# Altium schematic sheet ESP8266 MODULE.SchDoc
size A; SheetNumber: 15; SheetTotal: 30
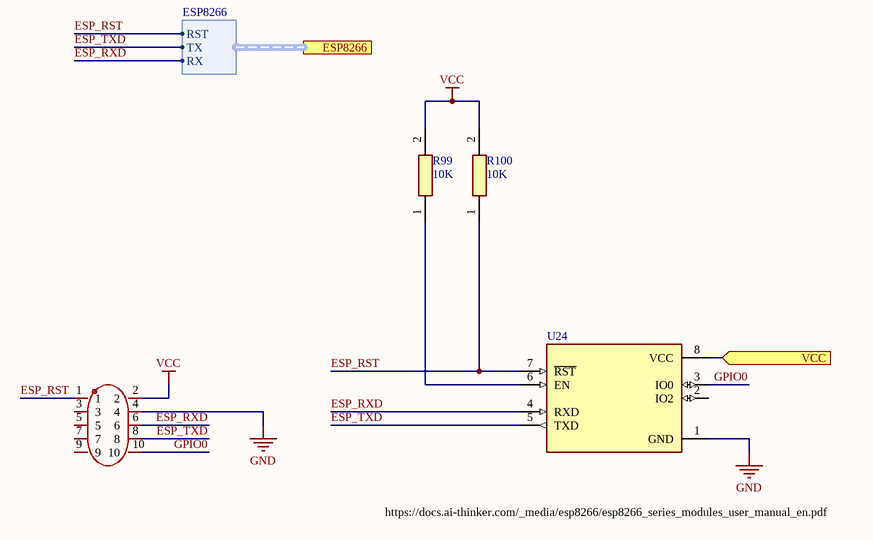
[diagram p0: ESP8266 MODULE.SchDoc]

## Parts
R99  10K  [r-0603]
R100  10K  [r-0603]
U24  (no value)  [XCVR_ESP8266-01/ESP-01]
U31  (no value)  [HDR-TH_10P-P2.54-V-M-R2-C5-S2.54]

## Ports
ESP8266 (harness ESP8266), VCC (in)

## Harnesses
ESP8266: RST, TX, RX

## Nets
GND: U24.1(GND) U31.4
VCC: R99.2 R100.2 U31.2
ESP_RST: R100.1 U24.7(~{RST}) U31.1 ; port ESP8266.RST
ESP_RXD: U24.4(RXD) U31.6 ; port ESP8266.RX
ESP_TXD: U24.5(TXD) U31.8 ; port ESP8266.TX
GPIO0: U24.3(IO0) U31.10
VCC: U24.8(VCC) ; port VCC  [a separate net that carries the same name]
NetR99_1: R99.1 U24.6(EN)

Not connected (* = marked no-connect by the designer): U24 2(IO2); U31 3 5 7 9

## Notes on the sheet
- https://docs.ai-thinker.com/_media/esp8266/esp8266_series_modules_user_manual_en.pdf

## Library data of the parts
R99 R100 = 0603WAF1002T5E: 100mW Thick Film Resistors ±100ppm/℃ ±1% 10kΩ 0603 Chip Resistor - Surface Mount ROHS; Manufacturer_Name: UNI-ROYAL(Uniroyal Elec); Datasheet Link: https://datasheet.lcsc.com/szlcsc/Uniroyal-Elec-0603WAF1002T5E_C25804.pdf; Height: 0.55mm; Manufacturer_Part_Number: 0603WAF1002T5E
U24 = ESP8266-01/ESP-01: MakerFocus 4pcs ESP8266 ESP-01 Serial Wireless WiFi Transceiver Receiver Module 1MB SPI Flash DC3.0-3.6V Internet of Things WiFi Module Board Compatible with Ar duino; Value: *; Package: None; MPN: ESP8266-01/ESP-01
U31 = ZX-PZ2.54-2-5PZZ: Gold 1kV 3A Direct Insert Policy 2.5mm 10P 6mm -40℃~+105℃ 3mm 2.54mm Brass Double Row Black 2.54mm 2x5P Plugin,P=2.54mm Pin Headers ROHS; Manufacturer: Megastar; LCSC: C7501276; MPN: ZX-PZ2.54-2-5PZZ; Package: 插件,P=2.54mm; Datasheet: https://atta.szlcsc.com/upload/public/pdf/source/20231122/7DD2FA5A7FDBC10CDDB6051CB6BC6AD1.pdf; Operating Temperature Range: -40℃~+105℃